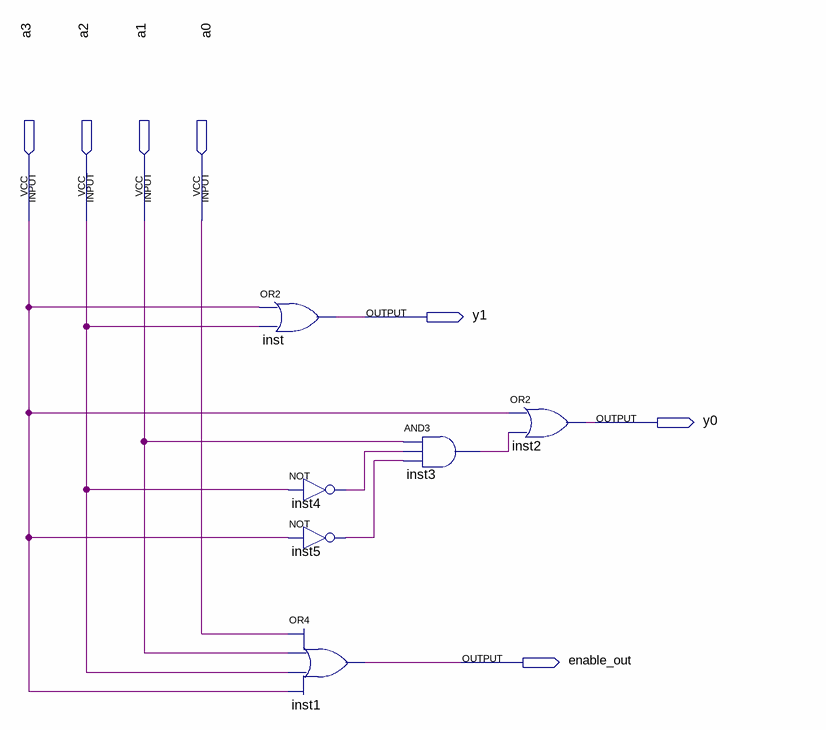
[diagram p0: schematic sheet]
// Quartus schematic codificador.bdf as structural Verilog: 6 symbols, 7 pins
module codificador (
  input  a3,
  input  a2,
  input  a1,
  input  a0,
  output y1,
  output y0,
  output enable_out
);

  wire inst3_out, inst4_out, inst5_out;

  or inst (y1, a3, a2);
  not inst4 (inst4_out, a2);
  not inst5 (inst5_out, a3);
  or inst1 (enable_out, a0, a1, a2, a3);
  and inst3 (inst3_out, a1, inst4_out, inst5_out);
  or inst2 (y0, a3, inst3_out);
endmodule
